# Altium schematic sheet 单片机系统电路symbol.SchDoc
size A4
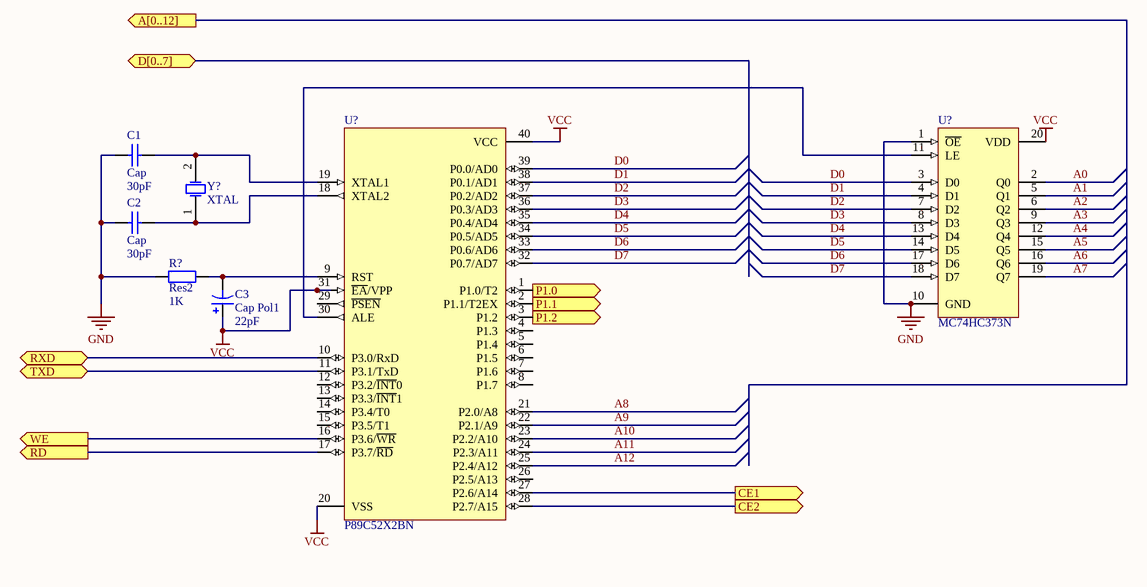
[diagram p0: 单片机系统电路symbol.SchDoc]

## Parts
(Parts that share a designator on the sheet are numbered #1, #2 ... from top to bottom, then left to right.)
C1  Cap  value 30pF  [RAD-0.3]
C2  Cap  value 30pF  [RAD-0.3]
C3  Cap Pol1  value 22pF  [RB7.6-15]
R?  Res2  value 1K  [AXIAL-0.4]
U?#1  P89C52X2BN  [SOT129-1]
U?#2  MC74HC373N  [738-03]
Y?  XTAL  [R38]

## Ports
A[0..12] (out), CE1 (out), CE2 (out), D[0..7] (bidir), P1.0 (out), P1.1 (out), P1.2 (out), RD (out), RXD (bidir), TXD (bidir), WE (out)

## Nets
GND: C1.1 C2.1 R?.1 U?#2.1(~{OE}) U?#2.10(GND)
VCC: C3.1 U?#1.20(VSS) U?#1.31(~{EA}/VPP) U?#1.40(VCC) U?#2.20(VDD)
A0: U?#2.2(Q0)
A1: U?#2.5(Q1)
A2: U?#2.6(Q2)
A3: U?#2.9(Q3)
A4: U?#2.12(Q4)
A5: U?#2.15(Q5)
A6: U?#2.16(Q6)
A7: U?#2.19(Q7)
A8: U?#1.21(P2.0/A8)
A9: U?#1.22(P2.1/A9)
A10: U?#1.23(P2.2/A10)
A11: U?#1.24(P2.3/A11)
A12: U?#1.25(P2.4/A12)
CE1: U?#1.27(P2.6/A14) ; port CE1
CE2: U?#1.28(P2.7/A15) ; port CE2
D0: U?#1.39(P0.0/AD0) U?#2.3(D0)
D1: U?#1.38(P0.1/AD1) U?#2.4(D1)
D2: U?#1.37(P0.2/AD2) U?#2.7(D2)
D3: U?#1.36(P0.3/AD3) U?#2.8(D3)
D4: U?#1.35(P0.4/AD4) U?#2.13(D4)
D5: U?#1.34(P0.5/AD5) U?#2.14(D5)
D6: U?#1.33(P0.6/AD6) U?#2.17(D6)
D7: U?#1.32(P0.7/AD7) U?#2.18(D7)
P1.0: U?#1.1(P1.0/T2) ; port P1.0
P1.1: U?#1.2(P1.1/T2EX) ; port P1.1
P1.2: U?#1.3(P1.2) ; port P1.2
RD: U?#1.17(P3.7/~{RD}) ; port RD
RXD: U?#1.10(P3.0/RxD) ; port RXD
TXD: U?#1.11(P3.1/TxD) ; port TXD
WE: U?#1.16(P3.6/~{WR}) ; port WE
NetC1_2: C1.2 U?#1.19(XTAL1) Y?.2(OSC2)
NetC2_2: C2.2 U?#1.18(XTAL2) Y?.1(OSC1)
NetC3_2: C3.2 R?.2 U?#1.9(RST)
NetU?#1_30: U?#1.30(ALE) U?#2.11(LE)

Not connected (* = marked no-connect by the designer): U?#1 4(P1.3) 5(P1.4) 6(P1.5) 7(P1.6) 8(P1.7) 12(P3.2/~{INT}0) 13(P3.3/~{INT}1) 14(P3.4/T0) 15(P3.5/T1) 26(P2.5/A13) 29(~{PSEN})

## Library data of the parts
C1 C2 = Cap: Capacitor; Published: 8-Jun-2000; LatestRevisionDate: 17-Jul-2002; LatestRevisionNote: Re-released for DXP Platform.; PackageReference: RAD-0.3; Publisher: Altium Limited; PackageDescription: Radial Cap, Thru-Hole; 2 Leads; 0.3 in Pin Spacing
C3 = Cap Pol1: Polarized Capacitor (Radial); Published: 8-Jun-2000; LatestRevisionDate: 17-Jul-2002; LatestRevisionNote: Re-released for DXP Platform.; PackageReference: RB7.6-15; Publisher: Altium Limited; PackageDescription: Polarized Capacitor (Radial); 2 Leads
R? = Res2: Resistor; Published: 8-Jun-2000; LatestRevisionDate: 17-Jul-2002; LatestRevisionNote: Re-released for DXP Platform.; PackageReference: AXIAL-0.4; Publisher: Altium Limited; PackageDescription: Axial Device, Thru-Hole; 2 Leads; 0.4 in Pin Spacing
U?#1 = P89C52X2BN: 80C51 8-Bit Flash Microcontroller Family, 8 kB Flash; Published: 21-May-2003; DatasheetVersion: 5-Jun-2002; PackageVersion: Aug-2000; PackageReference: SOT129-1; Publisher: Altium Limited; PackageDescription: DIP, Plastic; 40 Leads; Row Spacing 15.24 mm; Pitch 2.54 mm; Code_JEDEC: MO-015; ComponentLink1Description: Manufacturer Link; ComponentLink1URL: http://www-us2.semiconductors.philips.com/; ComponentLink2Description: Datasheet; ComponentLink2URL: http://www.semiconductors.philips.com/acrobat/datasheets/P89C5XX2_2.pdf
U?#2 = MC74HC373N: Octal 3-State Non-Inverting Transparent Latch; Published: 17-Jul-2002; LatestRevisionDate: 06-Jun-2005; LatestRevisionNote: Stylized 3D Model Added; DatasheetVersion: 1989; PackageReference: 738-03; Publisher: Altium Limited; PackageDescription: DIP; 20 Leads; Row Spacing 7.62 mm; Pitch 2.54 mm; Code_JEDEC: MS-001-AD; ComponentLink1Description: Manufacturer Link; ComponentLink1URL: http://www.onsemi.com/site/products/parametrics/0,4446,339,00.html
Y? = XTAL: Crystal Oscillator; Published: 8-Jun-2000; LatestRevisionDate: 17-Jul-2002; LatestRevisionNote: Re-released for DXP Platform.; PackageReference: R38; Publisher: Altium Limited; PackageDescription: Crystal, Thru-Hole; 2 Leads; Body 3.1 x 8.2 mm (Dia.xH)